# EAGLE design Auto20 (EAGLE 9.3.2)

## Sheet 1 of 3
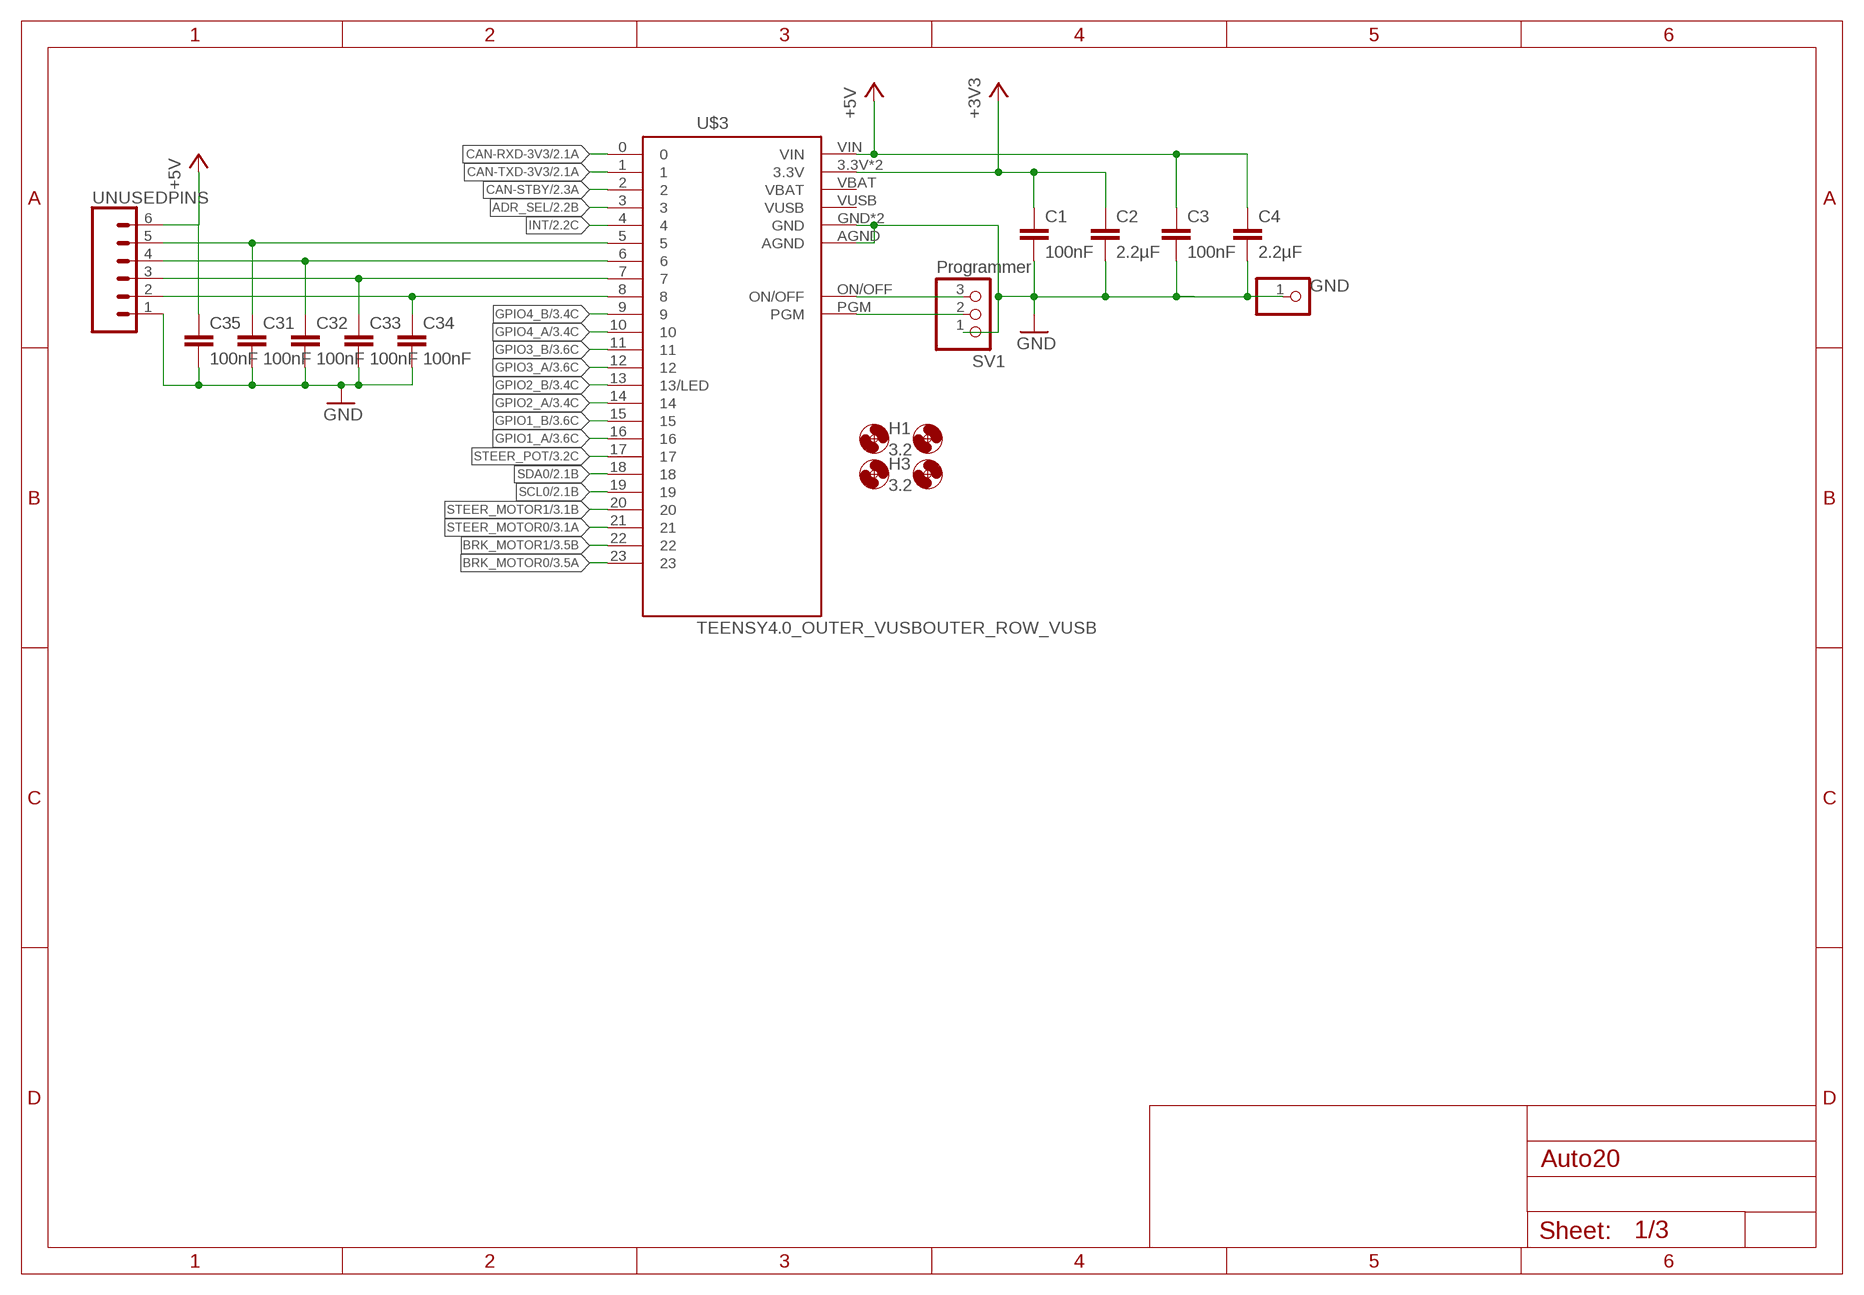
[diagram p0: schematic, sheet 1]

### Parts
C1  100nF  CAPACITOR_0805_L  [RESC0805_L]
C2  2.2µF  C-EUC1210  [C1210]
C3  100nF  CAPACITOR_0805_L  [RESC0805_L]
C4  2.2µF  C-EUC1210  [C1210]
C31  100nF  CAPACITOR_0805_L  [RESC0805_L]
C32  100nF  CAPACITOR_0805_L  [RESC0805_L]
C33  100nF  CAPACITOR_0805_L  [RESC0805_L]
C34  100nF  CAPACITOR_0805_L  [RESC0805_L]
C35  100nF  CAPACITOR_0805_L  [RESC0805_L]
GND  PINHD-1X1  [1X01]
H1  3.2  MOUNT-HOLE3.2  [3,2]
H2  3.2  MOUNT-HOLE3.2  [3,2]
H3  3.2  MOUNT-HOLE3.2  [3,2]
H4  3.2  MOUNT-HOLE3.2  [3,2]
SV1  Programmer  PINHD-1X3  [1X03]
U$3  TEENSY4.0_OUTER_VUSBOUTER_ROW_VUSB  [TEENSY_4.0_OUTER_VUSB]
UNUSEDPINS  CONN_06LOCK  [1X06_LOCK]

### Nets
+3V3: C1.1 C2.1 U$3.3.3V U$3.3.3V1(3.3V) ; also sheet 2
+5V: C3.1 C4.1 C35.1 U$3.VIN UNUSEDPINS.6 ; also sheet 2,3
ADR_SEL: U$3.3 ; also sheet 2
BRK_MOTOR0: U$3.23 ; also sheet 3
BRK_MOTOR1: U$3.22 ; also sheet 3
CAN-RXD-3V3: U$3.0 ; also sheet 2
CAN-STBY: U$3.2 ; also sheet 2
CAN-TXD-3V3: U$3.1 ; also sheet 2
GND: C1.2 C2.2 C3.2 C4.2 C31.2 C32.2 C33.2 C34.2 C35.2 GND.1 SV1.1 U$3.AGND U$3.GND U$3.GND1(GND) UNUSEDPINS.1 ; also sheet 2,3
GPIO1_A: U$3.16 ; also sheet 3
GPIO1_B: U$3.15 ; also sheet 3
GPIO2_A: U$3.14 ; also sheet 3
GPIO2_B: U$3.13(13/LED) ; also sheet 3
GPIO3_A: U$3.12 ; also sheet 3
GPIO3_B: U$3.11 ; also sheet 3
GPIO4_A: U$3.10 ; also sheet 3
GPIO4_B: U$3.9 ; also sheet 3
INT: U$3.4 ; also sheet 2
N$1: C31.1 U$3.5 UNUSEDPINS.5
N$3: SV1.3 U$3.ON/OFF
N$4: SV1.2 U$3.PGM
N$10: C32.1 U$3.6 UNUSEDPINS.4
N$12: C33.1 U$3.7 UNUSEDPINS.3
N$13: C34.1 U$3.8 UNUSEDPINS.2
SCL0: U$3.19 ; also sheet 2
SDA0: U$3.18 ; also sheet 2
STEER_MOTOR0: U$3.21 ; also sheet 3
STEER_MOTOR1: U$3.20 ; also sheet 3
STEER_POT: U$3.17 ; also sheet 3
Unconnected: U$3.VBAT U$3.VUSB

## Sheet 2 of 3
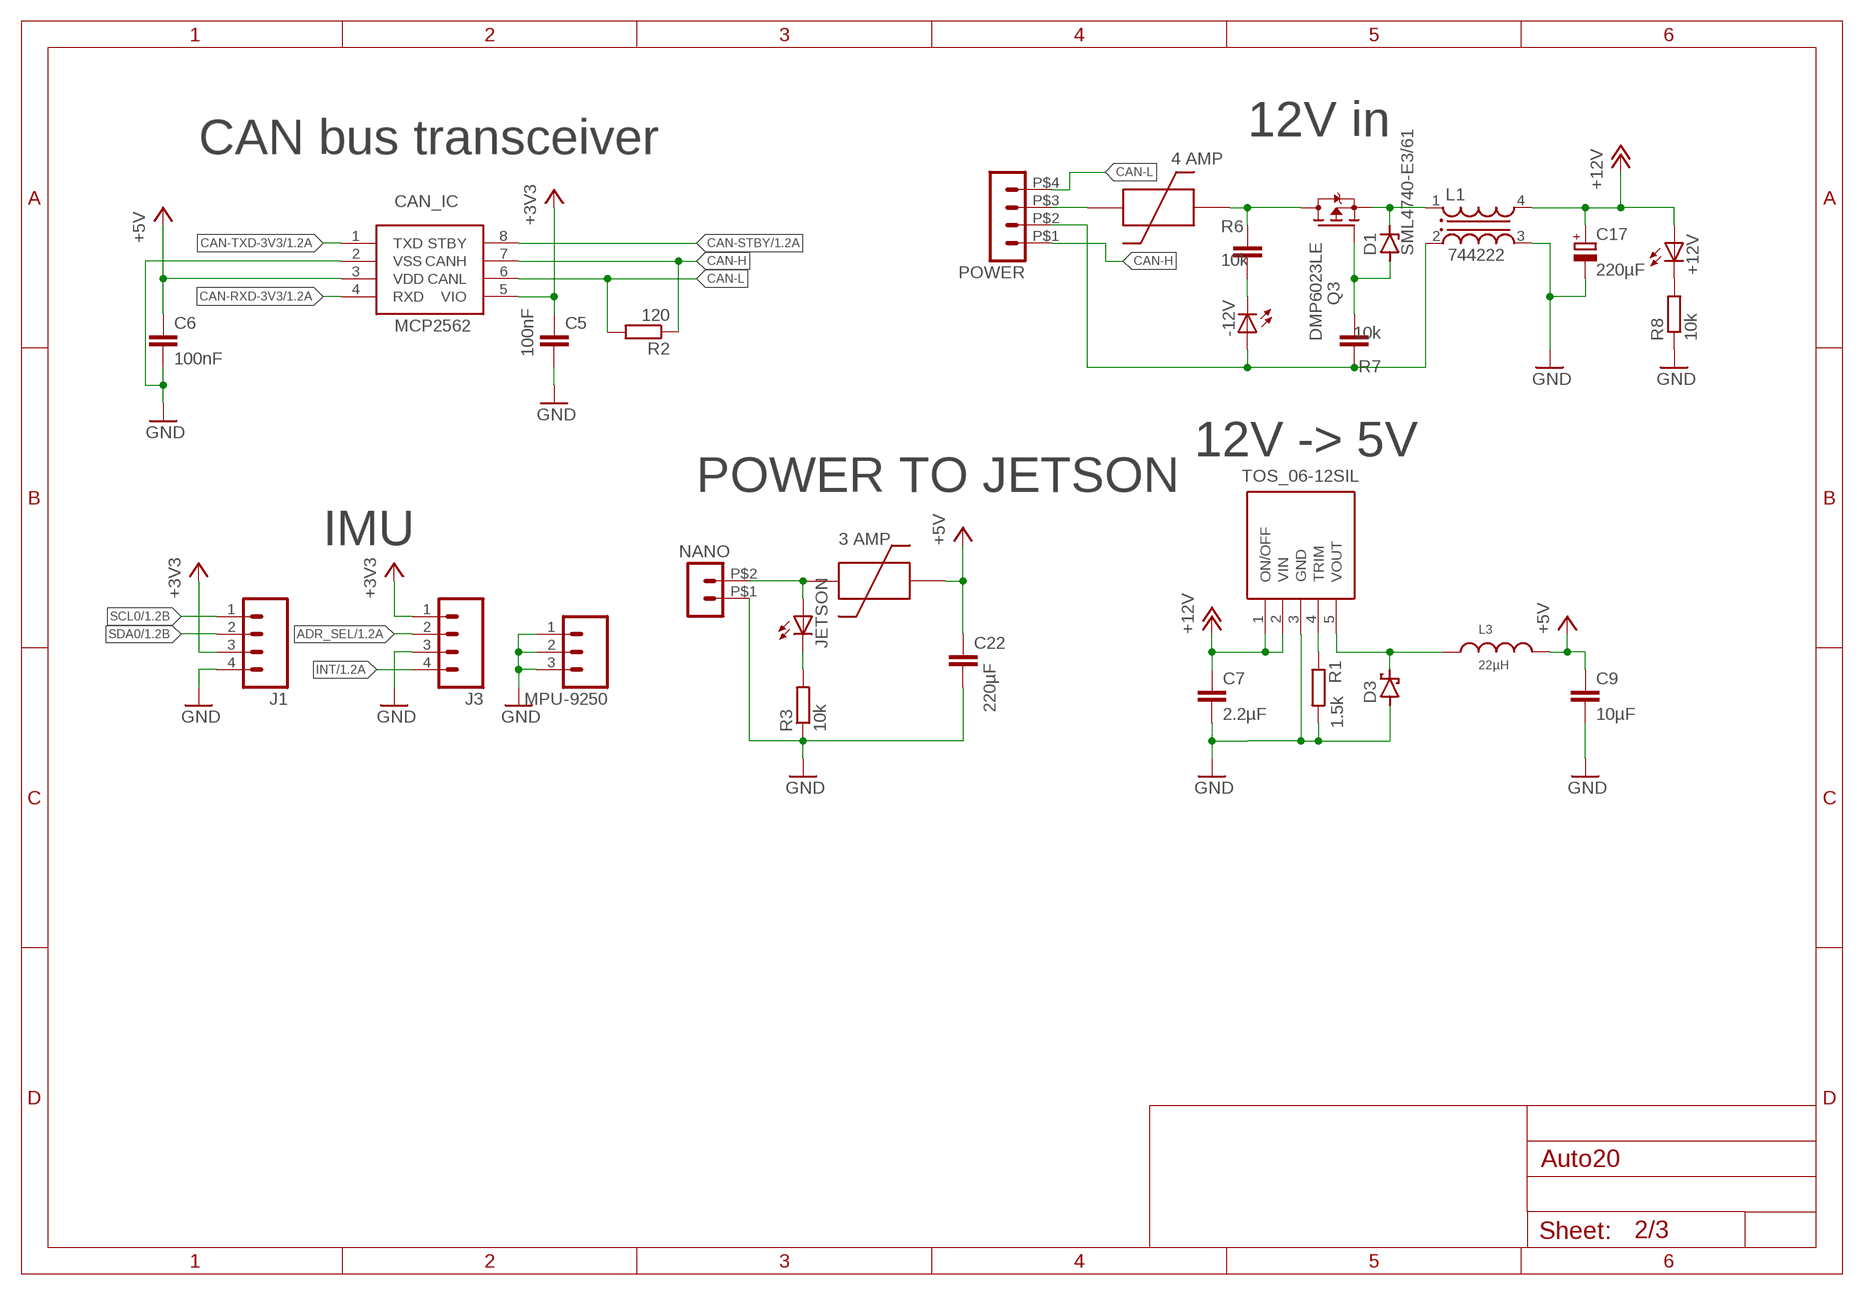
[diagram p1: schematic, sheet 2]

### Parts
+12V  LEDSMT1206  [1206]
-12V  LEDSMT1206  [1206]
C5  100nF  CAPACITOR_0805_L  [RESC0805_L]
C6  100nF  CAPACITOR_0805_L  [RESC0805_L]
C7  2.2µF  C-EUC1210  [C1210]
C9  10µF  C-EUC1210  [C1210]
C17  220µF  CPOL-EUE  [PANASONIC_E]
C22  220µF  C-EUC1210  [C1210]
CAN_IC  MCP2562  [SOIC127P600X175-8]
D1  SML4740-E3/61  ZENERSMA  [DO214AC]
D3  SBR1U150SA  SBRSMA  [DO214AC]
IC1  TOS_06-12SIL  [TOS-06-12SIL-6A]
J1  M04PTH  [1X04]
J3  M04PTH  [1X04]
JETSON  LEDSMT1206  [1206]
L1  744222  WE-SL2_744222  [WE-SL2]
L3  22µH  WE-PD_7345_PLASTIC_7447779122  [WE-PD_7332/7345_PLASTIC_BASE]
MPU-9250  M03PTH  [1X03]
NANO  HEADER_POS2_43045-0200  [43045-0200]
POWER  HEADER_POS4_43045-0401  [43045-0400]
Q3  DMP6023LE  BSP170P  [SOT223]
R1  1.5k  R-EU_R0805  [R0805]
R2  120  R-EU_R0603  [R0603]
R3  10k  R-EU_R0805  [R0805]
R6  10k  CAPACITOR_0805_L  [RESC0805_L]
R7  10k  CAPACITOR_0805_L  [RESC0805_L]
R8  10k  R-EU_R0805  [R0805]
U$1  SMF_OMNI-BLOK_FUSE_BLOCK  [SMF_OMNI-BLOK_FUSE_BLOCK]
U$2  SMF_OMNI-BLOK_FUSE_BLOCK  [SMF_OMNI-BLOK_FUSE_BLOCK]

### Nets
+3V3: C5.1 CAN_IC.5(VIO) J1.3 J3.1 ; also sheet 1
+5V: C6.1 C9.1 C22.1 CAN_IC.3(VDD) L3.2 U$1.PIN2 ; also sheet 1,3
+12V: +12V.A C7.1 C17.+ IC1.1(ON/OFF) IC1.2(VIN) L1.4
ADR_SEL: J3.2 ; also sheet 1
CAN-H: CAN_IC.7(CANH) POWER.P$1 R2.1
CAN-L: CAN_IC.6(CANL) POWER.P$4 R2.2
CAN-RXD-3V3: CAN_IC.4(RXD) ; also sheet 1
CAN-STBY: CAN_IC.8(STBY) ; also sheet 1
CAN-TXD-3V3: CAN_IC.1(TXD) ; also sheet 1
GND: C5.2 C6.2 C7.2 C9.2 C17.- C22.2 CAN_IC.2(VSS) D3.A IC1.3(GND) J1.4 J3.3 L1.3 MPU-9250.1 MPU-9250.2 MPU-9250.3 NANO.P$1 R1.2 R3.1 R8.1 ; also sheet 1,3
INT: J3.4 ; also sheet 1
N$5: D3.C IC1.5(VOUT) L3.1
N$6: POWER.P$3 U$2.PIN1
N$7: IC1.4(TRIM) R1.1
N$9: JETSON.C R3.2
N$11: JETSON.A NANO.P$2 U$1.PIN1
N$24: D1.C L1.1 Q3.3(S)
N$25: -12V.A L1.2 POWER.P$2 R7.1
N$27: Q3.2(D) Q3.4(D) R6.1 U$2.PIN2
N$28: D1.A Q3.1(G) R7.2
N$31: -12V.C R6.2
N$32: +12V.C R8.2
SCL0: J1.1 ; also sheet 1
SDA0: J1.2 ; also sheet 1

### Notes on the sheet
- 12V in
- CAN bus transceiver
- 4 AMP
- 12V -> 5V
- POWER TO JETSON
- IMU | 3 AMP

## Sheet 3 of 3
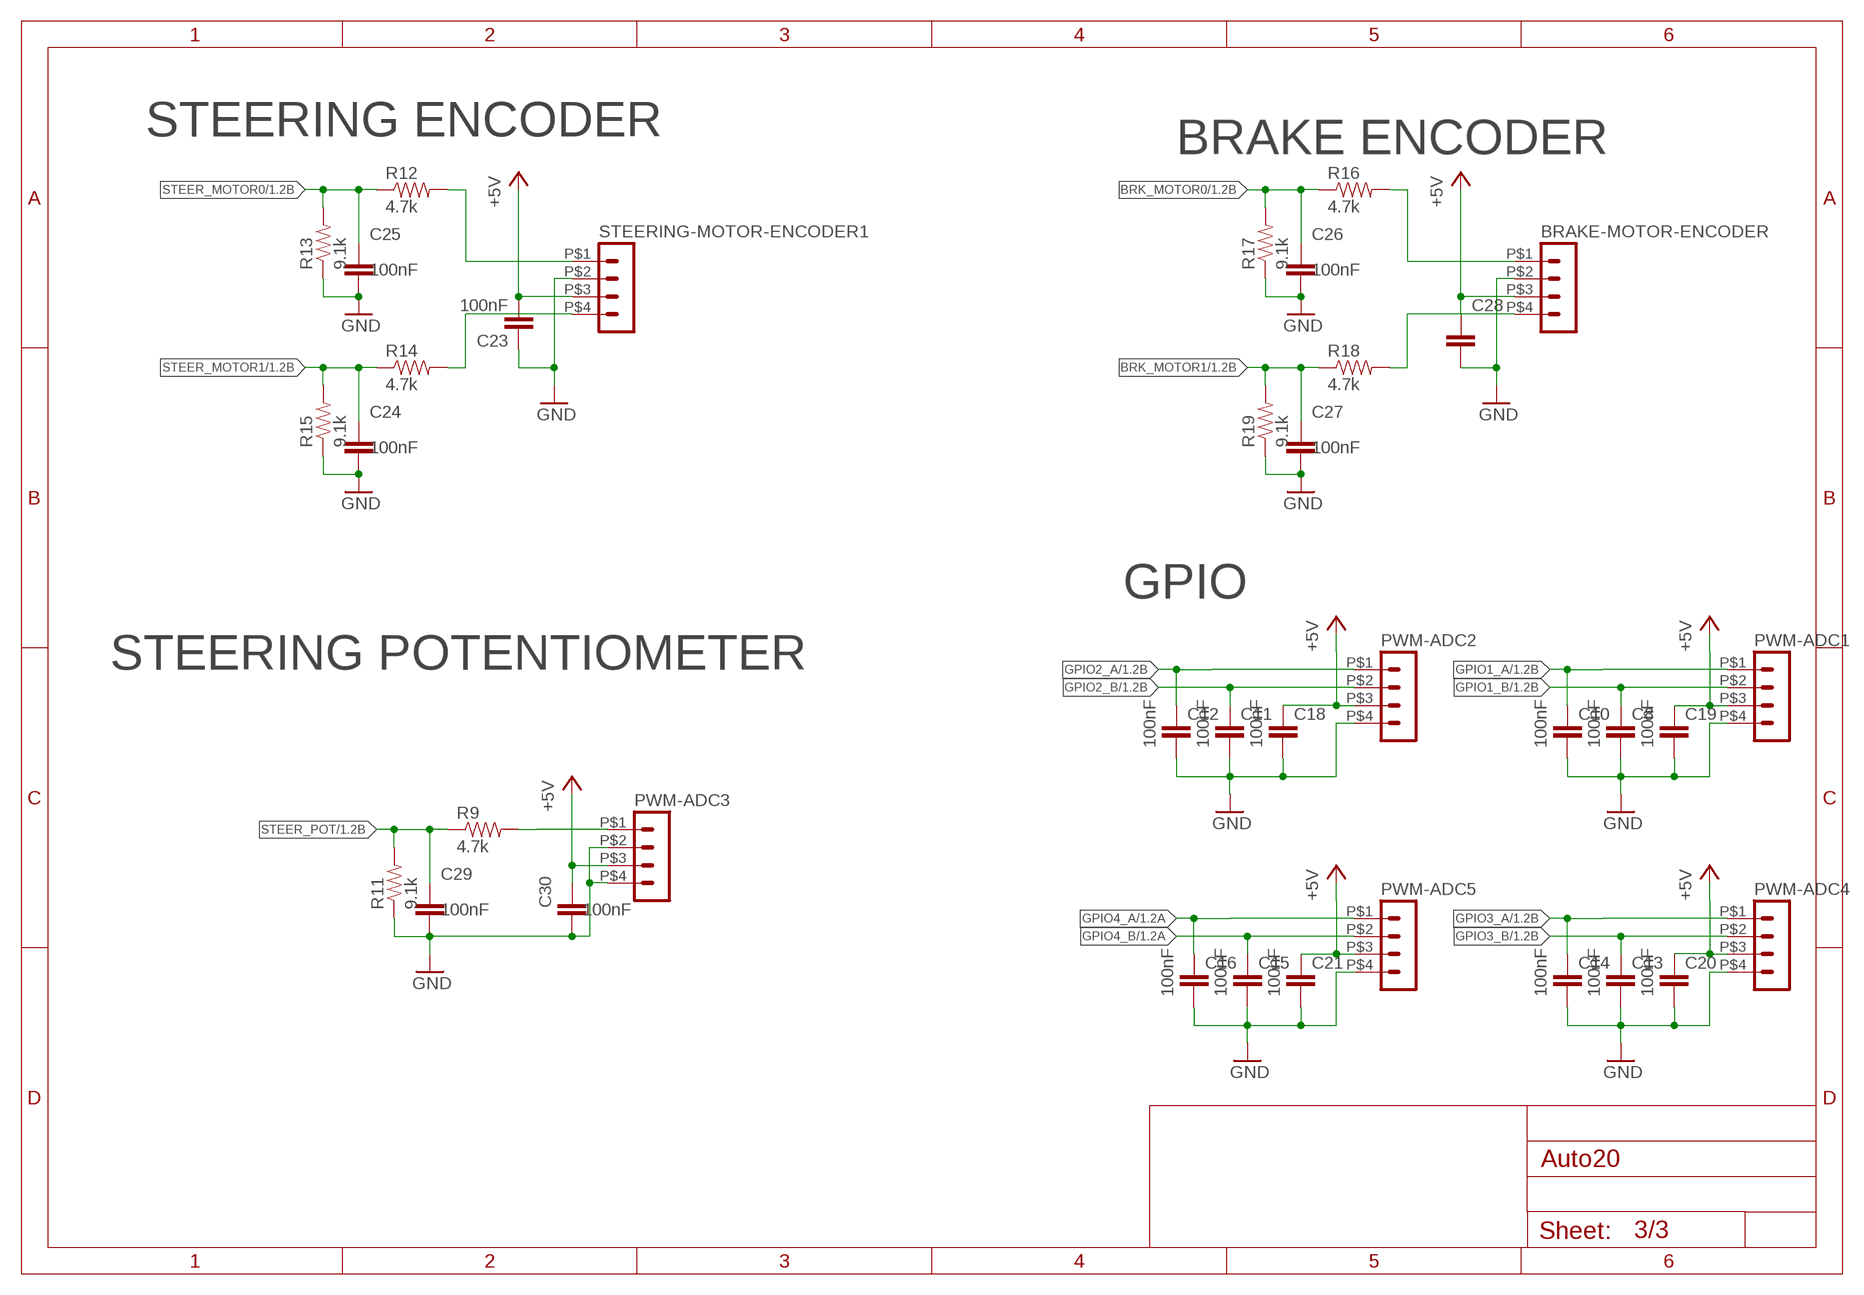
[diagram p2: schematic, sheet 3]

### Parts
BRAKE-MOTOR-ENCODER  HEADER_POS4_43045-0401  [43045-0400]
C8  100nF  CAPACITOR_0805_L  [RESC0805_L]
C10  100nF  CAPACITOR_0805_L  [RESC0805_L]
C11  100nF  CAPACITOR_0805_L  [RESC0805_L]
C12  100nF  CAPACITOR_0805_L  [RESC0805_L]
C13  100nF  CAPACITOR_0805_L  [RESC0805_L]
C14  100nF  CAPACITOR_0805_L  [RESC0805_L]
C15  100nF  CAPACITOR_0805_L  [RESC0805_L]
C16  100nF  CAPACITOR_0805_L  [RESC0805_L]
C18  100nF  CAPACITOR_0805_L  [RESC0805_L]
C19  100nF  CAPACITOR_0805_L  [RESC0805_L]
C20  100nF  CAPACITOR_0805_L  [RESC0805_L]
C21  100nF  CAPACITOR_0805_L  [RESC0805_L]
C23  100nF  CAPACITOR_0805_L  [RESC0805_L]
C24  100nF  CAPACITOR_0805_L  [RESC0805_L]
C25  100nF  CAPACITOR_0805_L  [RESC0805_L]
C26  100nF  CAPACITOR_0805_L  [RESC0805_L]
C27  100nF  CAPACITOR_0805_L  [RESC0805_L]
C28  100nF  CAPACITOR_0805_L  [RESC0805_L]
C29  100nF  CAPACITOR_0805_L  [RESC0805_L]
C30  100nF  CAPACITOR_0805_L  [RESC0805_L]
PWM-ADC1  HEADER_POS4_43045-0401  [43045-0400]
PWM-ADC2  HEADER_POS4_43045-0401  [43045-0400]
PWM-ADC3  HEADER_POS4_43045-0401  [43045-0400]
PWM-ADC4  HEADER_POS4_43045-0401  [43045-0400]
PWM-ADC5  HEADER_POS4_43045-0401  [43045-0400]
R9  4.7k  RESISTOR0805-RES  [0805]
R11  9.1k  RESISTOR0805-RES  [0805]
R12  4.7k  RESISTOR0805-RES  [0805]
R13  9.1k  RESISTOR0805-RES  [0805]
R14  4.7k  RESISTOR0805-RES  [0805]
R15  9.1k  RESISTOR0805-RES  [0805]
R16  4.7k  RESISTOR0805-RES  [0805]
R17  9.1k  RESISTOR0805-RES  [0805]
R18  4.7k  RESISTOR0805-RES  [0805]
R19  9.1k  RESISTOR0805-RES  [0805]
STEERING-MOTOR-ENCODER1  HEADER_POS4_43045-0401  [43045-0400]

### Nets
+5V: BRAKE-MOTOR-ENCODER.P$3 C18.1 C19.1 C20.1 C21.1 C23.2 C28.1 C30.1 PWM-ADC1.P$3 PWM-ADC2.P$3 PWM-ADC3.P$3 PWM-ADC4.P$3 PWM-ADC5.P$3 STEERING-MOTOR-ENCODER1.P$3 ; also sheet 1,2
ADC3-RAW: PWM-ADC3.P$1 R9.2
ADC9-RAW: BRAKE-MOTOR-ENCODER.P$4 R18.2
ADC9-RAW1: R14.2 STEERING-MOTOR-ENCODER1.P$4
BRK_MOTOR0: C26.1 R16.1 R17.2 ; also sheet 1
BRK_MOTOR1: C27.1 R18.1 R19.2 ; also sheet 1
GND: BRAKE-MOTOR-ENCODER.P$2 C8.2 C10.2 C11.2 C12.2 C13.2 C14.2 C15.2 C16.2 C18.2 C19.2 C20.2 C21.2 C23.1 C24.2 C25.2 C26.2 C27.2 C28.2 C29.2 C30.2 PWM-ADC1.P$4 PWM-ADC2.P$4 PWM-ADC3.P$2 PWM-ADC3.P$4 PWM-ADC4.P$4 PWM-ADC5.P$4 R11.1 R13.1 R15.1 R17.1 R19.1 STEERING-MOTOR-ENCODER1.P$2 ; also sheet 1,2
GPIO1_A: C10.1 PWM-ADC1.P$1 ; also sheet 1
GPIO1_B: C8.1 PWM-ADC1.P$2 ; also sheet 1
GPIO2_A: C12.1 PWM-ADC2.P$1 ; also sheet 1
GPIO2_B: C11.1 PWM-ADC2.P$2 ; also sheet 1
GPIO3_A: C14.1 PWM-ADC4.P$1 ; also sheet 1
GPIO3_B: C13.1 PWM-ADC4.P$2 ; also sheet 1
GPIO4_A: C16.1 PWM-ADC5.P$1 ; also sheet 1
GPIO4_B: C15.1 PWM-ADC5.P$2 ; also sheet 1
N$2: BRAKE-MOTOR-ENCODER.P$1 R16.2
N$8: R12.2 STEERING-MOTOR-ENCODER1.P$1
STEER_MOTOR0: C25.1 R12.1 R13.2 ; also sheet 1
STEER_MOTOR1: C24.1 R14.1 R15.2 ; also sheet 1
STEER_POT: C29.1 R9.1 R11.2 ; also sheet 1

### Notes on the sheet
- STEERING ENCODER
- BRAKE ENCODER
- GPIO
- STEERING POTENTIOMETER

## Library data of the parts
+12V -12V JETSON = adafruit:LED: LED OSRAM: - CHIPLED LG R971, LG N971, LY N971, LG Q971, LY Q971, LO R971, LY R971 LH N974, LH R974 LS Q976, LO Q976, LY Q976 LO Q996 - Hyper CHIPLED LW Q18S LB Q993, LB Q99A, LB R99A - SideLED LS A670, LO A670, LY A670, LG A670, LP A670 LB A673, LV A673, LT A673, LW A673 LH A674 LY A675 LS A676, LA A676, LO A676, LY A676, LW A676 LS A679, LY A679, LG A679 - Hyper Micro SIDELED® LS Y876, LA Y876, LO Y876, LY Y876 LT Y87S - SmartLED LW L88C, LW L88S LB L89C, LB L89S, LG L890 LS L89K, LO L89K, LY L89K LS L896, LA L896, LO L896, LY L896 - TOPLED LS T670, LO T670, LY T670, LG T670, LP T670 LSG T670, LSP T670, LSY T670, LOP T670, LYG T670 LG T671, LOG T671, LSG T671 LB T673, LV T673, LT T673, LW T673 LH T674 LS T676, LA T676, LO T676, LY T676, LB T676, LH T676, LSB T676, LW T676 LB T67C, LV T67C, LT T67C, LS T67K, LO T67K, LY T67K, LW E67C LS E67B, LA E67B, LO E67B, LY E67B, LB E67C, LV E67C, LT E67C LW T67C LS T679, LY T679, LG T679 LS T770, LO T770, LY T770, LG T770, LP T770 LB T773, LV T773, LT T773, LW T773 LH T774 LS E675, LA E675, LY E675, LS T675 LS T776, LA T776, LO T776, LY T776, LB T776 LHGB T686 LT T68C, LB T68C - Hyper Mini TOPLED® LB M676 - Mini TOPLED Santana® LG M470 LS M47K, LO M47K, LY M47K Source: http://www.osram.convergy.de/
BRAKE-MOTOR-ENCODER POWER PWM-ADC1-PWM-ADC5 STEERING-MOTOR-ENCODER1 = con-molex-micro-fit-3_0:HEADER_POS4_?: Molex - Micro-Fit 3.0 Series connector, 3.00mm (0.118") pitch header, 4 positions.
C1 C3 C5 C6 C8 C10-C16 C18-C21 C23-C35 R6 R7 = Nordic_nRF:CAPACITOR: Generic chip capacitor
C2 C4 C7 C9 = rcl:C-EU: CAPACITOR, European symbol; SPICEPREFIX: C
C17 = rcl:CPOL-EU: POLARIZED CAPACITOR, European symbol; SPICEPREFIX: C
C22 = resistor:C-EU: CAPACITOR, European symbol
CAN_IC = MCP2562:MCP2562
D1 = Diode_Own:ZENER
D3 = Diode_Own:SBR
GND = adafruit:PINHD-1X1: Pin header 1x1 for 0.1" spacing With round pins
H1-H4 = holes:MOUNT-HOLE: MOUNTING HOLE with drill center marker
IC1 = SamacSys_Parts:TOS_06-12SIL: Non-Isolated DC-DC Converter 12V dc Input, 0.75 ??5V dc Output, 6A%0%0 Source: Datasheet <http://www.tracopower.com/products/tos.pdf>; DESCRIPTION: Non-Isolated DC-DC Converter 12V dc Input, 0.75 ??5V dc Output, 6A%0%0; HEIGHT: mm; MANUFACTURER_NAME: Traco Power; MANUFACTURER_PART_NUMBER: TOS 06-12SIL; RS_PART_NUMBER: 7066432; RS_PRICE-STOCK: https://uk.rs-online.com/web/p/products/7066432
J1 J3 = SparkFun-Connectors:M04: Header 4 Standard 4-pin 0.1" header. Use with straight break away headers (SKU : PRT-00116), right angle break away headers (PRT-00553), swiss pins (PRT-00743), machine pins (PRT-00117), and female headers (PRT-00115). Molex polarized connector foot print use with SKU : PRT-08231 with associated crimp pins and housings. 1MM SMD Version SKU: PRT-10208; PROD_ID: CONN-09696
L1 = Wurth_Elektronik_Passive_rev18f:WE-SL2: SMD Common-Mode Line Filter WE-SL2 For distortion-free removal of noise from transmitted electrical signals - Double current-compensated choke - Offering a wide band width with the core materials NiZn/MnZn -- Current compensated choke for data and signal lines -- Power supply systems -- Filter for measurement signals -- CAN <http://katalog.we-online.de/media/images/v2/Family_WE-SL2.jpg> Details see: http://katalog.we-online.de/en/pbs/WE-SL2? Updated by Dan Xu 2014-07-11 2014 (C) Würth Elektronik; WE-NUMBER: 744222/1000uH
L3 = Wurth_Elektronik_Passive_rev18f:WE-PD_7345_PLASTIC: SMD Shielded Power Inductor Characteristics Magnetically shielded version which results in a low leakage field High Saturation currents up to 25 A Very low self-losses at high switching frequency‘s Wide inductances spectrum available at all sizes Operating temperature: –40 °C to +125 °C Applications Perfectly suitable for switching regulators with extremely high efficiency Integrated DC/DC- converter Switching regulators with low operating voltages (Graphic cards, embedded PC-Cards, Mainboards) Plastic base: Because of the one piece construction these are more suitable for high vibration or shock applications <http://katalog.we-online.de/media/images/v2/Family_WE-PD.jpg> Details see: http://katalog.we-online.de/en/pbs/WE-PD? Updated by Dan Xu 2014-07-08 2014 (C) Wurth Elektronik; WE-NUMBER: 7447779122/22uH
MPU-9250 = SparkFun-Connectors:M03: Header 3 Standard 3-pin 0.1" header. Use with straight break away headers (SKU : PRT-00116), right angle break away headers (PRT-00553), swiss pins (PRT-00743), machine pins (PRT-00117), and female headers (PRT-00115). Molex polarized connector foot print use with SKU : PRT-08232 with associated crimp pins and housings.
NANO = con-molex-micro-fit-3_0:HEADER_POS2_?: Molex - Micro-Fit 3.0 Series connector, 3.00mm (0.118") pitch header, 2 positions.
Q3 = transistor-fet:BSP170P: SIPMOS(R) Small-Signal-Transistor P-Channel, Enhancement mode Source: http://www.infineon.com/upload/Document/BSP170P_Rev2.4.pdf
R1-R3 R8 = rcl:R-EU_: RESISTOR, European symbol; SPICEPREFIX: R
R9 R11-R19 = SparkFun-Resistors:RESISTOR: Resistor Basic schematic elements and footprints for 0603, 1206, and PTH resistors.
SV1 = pinhead:PINHD-1X3: PIN HEADER
U$1 U$2 = SMF_OMNI-BLOK_FUSE_BLOCK:SMF_OMNI-BLOK_FUSE_BLOCK
U$3 = Teensy_4_0:TEENSY4.0_OUTER_VUSB
UNUSEDPINS = SparkFun-Connectors:CONN_06: Multi connection point. Often used as Generic Header-pin footprint for 0.1 inch spaced/style header connections On any of the 0.1 inch spaced packages, you can populate with these: Break Away Headers - Straight <https://www.sparkfun.com/products/116> (PRT-00116) Break Away Male Headers - Right Angle <https://www.sparkfun.com/products/553> (PRT-00553) Female Headers <https://www.sparkfun.com/products/115> (PRT-00115) Break Away Headers - Machine Pin <https://www.sparkfun.com/products/117> (PRT-00117) Break Away Female Headers - Swiss Machine Pin <https://www.sparkfun.com/products/743> (PRT-00743) Arduino Stackable Header - 6 Pin <https://www.sparkfun.com/products/9280> (PRT-09280) For SCREWTERMINALS and SPRING TERMINALS visit here: Screw Terimnals on SparkFun.com <https://www.sparkfun.com/search/results?term=Screw+Terminals> (5mm/3.5mm/2.54mm spacing) This device is also useful as a general connection point to wire up your design to another part of your project. Our various solder wires solder well into these plated through hole pads. Hook-Up Wire - Assortment (Stranded, 22 AWG) <https://www.sparkfun.com/products/11375> (PRT-11375) Hook-Up Wire - Assortment (Solid Core, 22 AWG) <https://www.sparkfun.com/products/11367> (PRT-11367) View the entire wire category on our website here <https://www.sparkfun.com/categories/141>

## Board
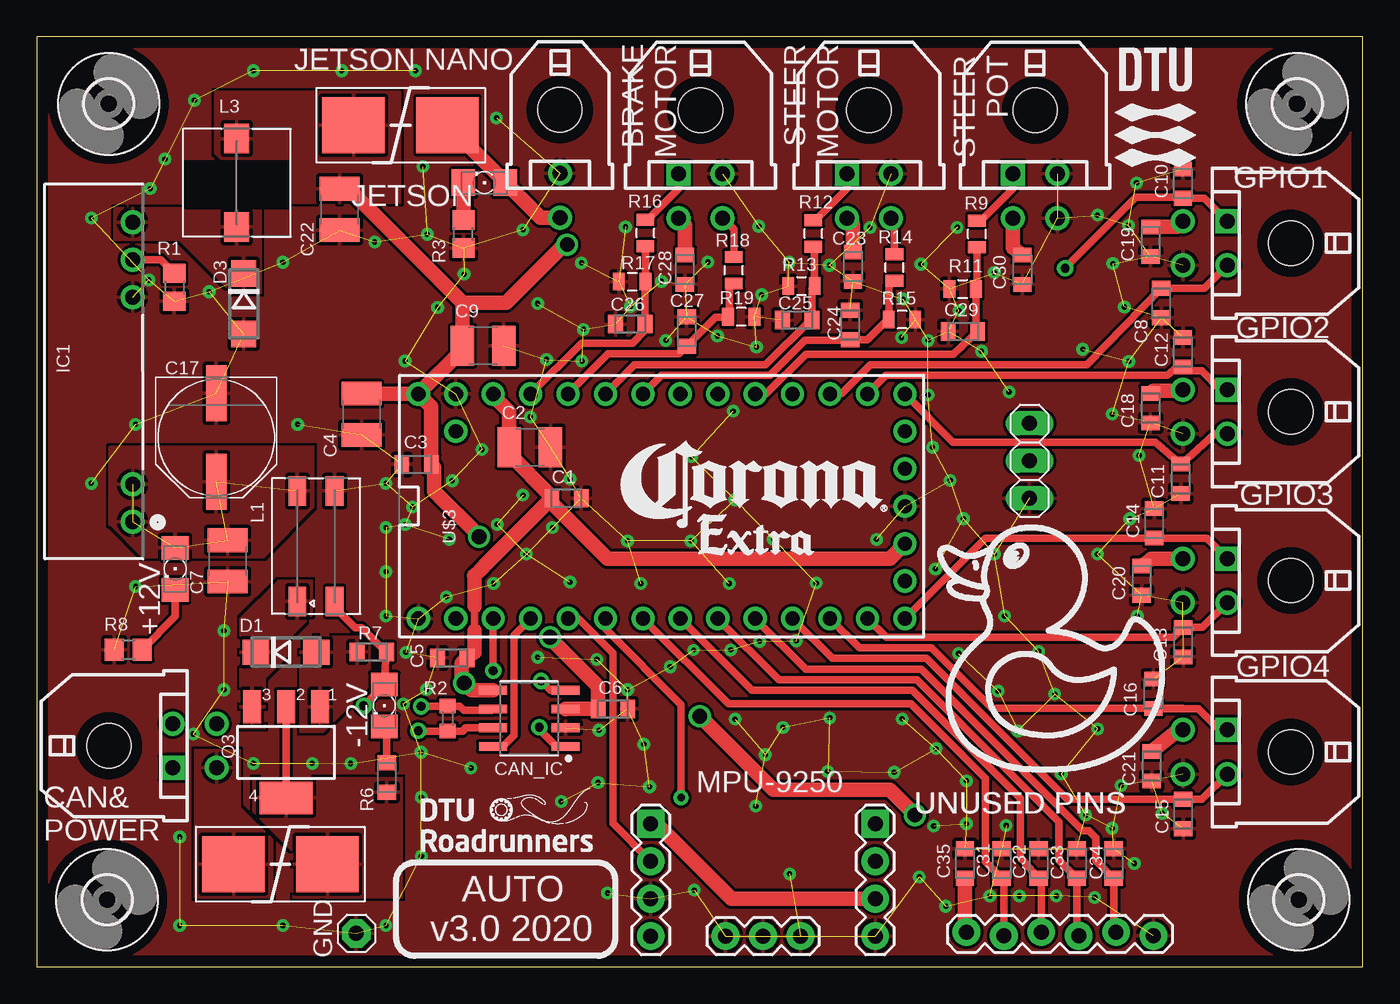
[diagram p3: board, top side]
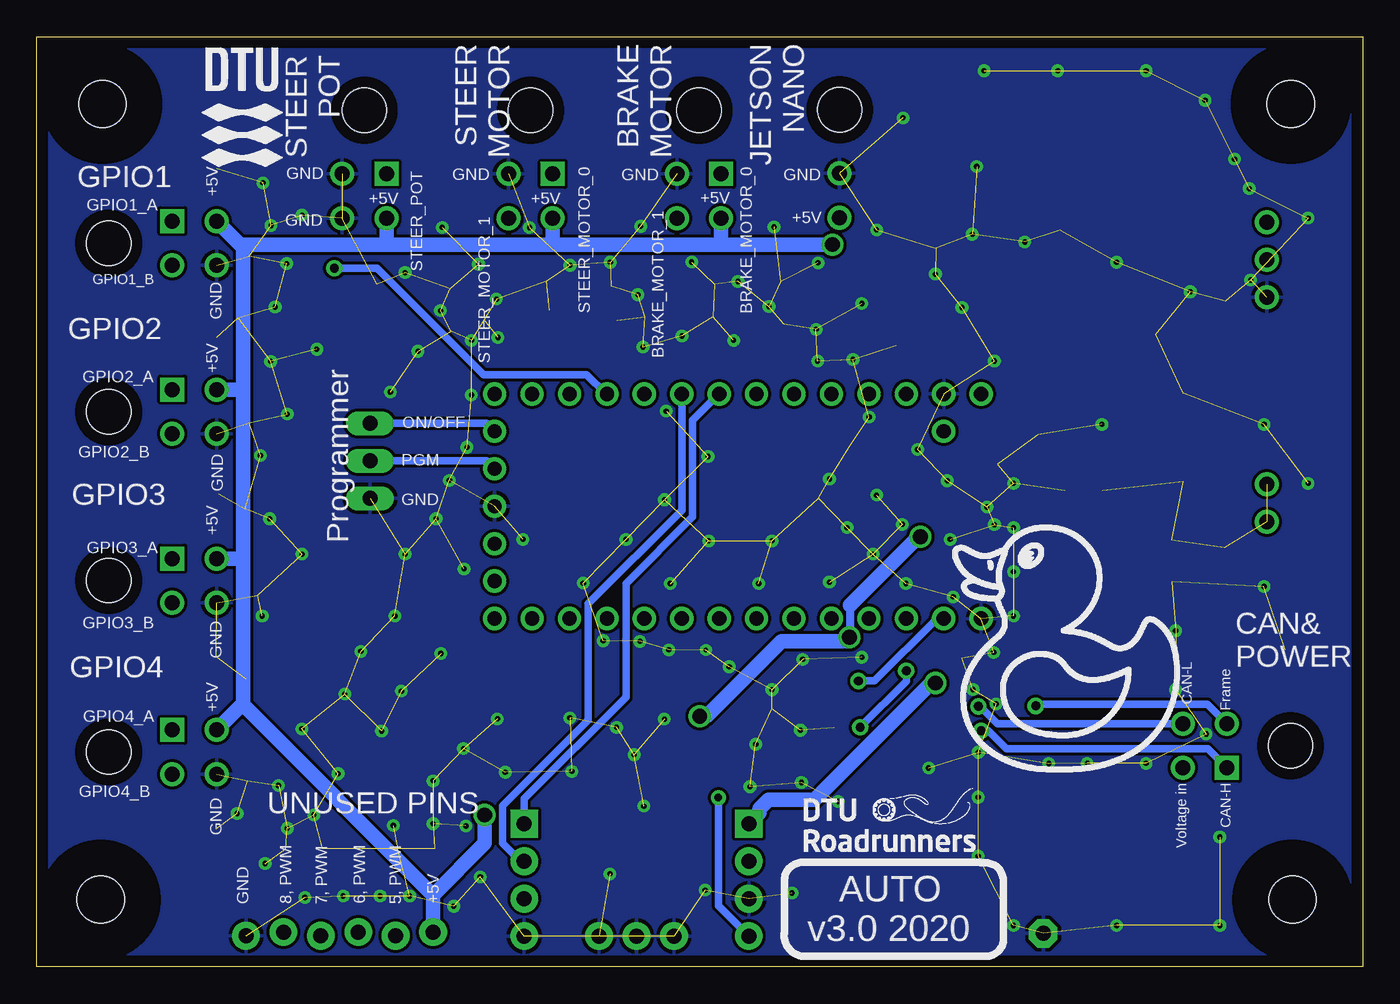
[diagram p4: board, bottom side, seen from below]

Size 90 x 63.1 mm. Coordinates in mm from the lower left corner, seen from the top.
Outline: 0,0 90,0 90,63.1 0,63.1 0,0
Copper layers (1*16): Top 0.035mm / dielectric 1.5mm / Bottom 0.035mm
Design rules "CustomSparkFun2Layer": minimum track width 16mil, minimum drill 20mil, track to track 8mil, track to pad 8mil, pad to pad 8mil, via to via 8mil, smd to smd 8mil, copper to edge 30mil, drill to drill 8mil, minimum pad ring 12mil, minimum via ring 10mil, stop-mask expansion 4mil, vias tented up to drill 25mil, thermal gap 10mil

### Footprints (pad centres in the part's own frame; a part is rotated, then mirrored left to right if it is on the bottom)
1206 = smd 1.6 x 1.803: A -1.422,0; C 1.422,0
43045-0400 = drill 1.02 square: P$1 1.5,4.32 | drill 1.02: P$2 -1.5,4.32; P$3 1.5,7.32; P$4 -1.5,7.32 | hole 3: 0,0
RESC0805_L = smd 1 x 1.25: 1 -1,0; 2 1,0
C1210 = smd 1.6 x 2.7: 1 -1.4,0; 2 1.4,0
PANASONIC_E = smd 3.8 x 1.4: + 3,0; - -3,0
SOIC127P600X175-8 = smd 1.901 x 0.599: 1 -2.455,1.905; 2 -2.455,0.635; 3 -2.455,-0.635; 4 -2.455,-1.905; 5 2.455,-1.905; 6 2.455,-0.635; 7 2.455,0.635; 8 2.455,1.905
DO214AC = smd 1.8 x 1.7: A 2.05,0; C -2.05,0
1X01 = drill 1.016 pad 1.93 octagon: 1 0,0
3,2 = hole 3.2: 0,0
TOS-06-12SIL-6A = drill 1.02 pad 1.52: 1 0,0; 2 2.54,0; 3 15.24,0; 4 17.78,0; 5 20.32,0
1X04 = drill 1.016 pad 1.88 square: 1 0,0 | drill 1.016 pad 1.88: 2 2.54,0; 3 5.08,0; 4 7.62,0
WE-SL2 = smd 2 x 1.2: 1 -3.75,1.27; 2 -3.75,-1.27; 3 3.75,-1.27; 4 3.75,1.27
WE-PD_7332/7345_PLASTIC_BASE = smd 2 x 1.7: 1 -3,0; 2 3,0
1X03 = drill 1.016 pad 1.88: 1 0,0; 2 2.54,0; 3 5.08,0
43045-0200 = drill 1.02: P$1 0,4.32; P$2 0,7.32 | hole 3: 0,0
SOT223 = smd 1.219 x 2.235: 1 -2.311,-3.099; 2 0,-3.099; 3 2.311,-3.099 | smd 3.6 x 2.2: 4 0,3.099
R0805 = smd 1.3 x 1.5: 1 -0.95,0; 2 0.95,0
R0603 = smd 1 x 1.1: 1 -0.85,0; 2 0.85,0
0805 = smd 0.8 x 1.2: 1 -0.9,0; 2 0.9,0
1X03' = drill 1.016 long: 1 -2.54,0; 2 0,0; 3 2.54,0
SMF_OMNI-BLOK_FUSE_BLOCK = smd 4.242 x 3.81: PIN1 -3.175,0; PIN2 3.2,0
TEENSY_4.0_OUTER_VUSB = drill 0.965: 0 -7.62,13.97; 1 -7.62,11.43; 2 -7.62,8.89; 3 -7.62,6.35; 3.3V 7.62,11.43; 3.3V1 -2.54,-16.51; 4 -7.62,3.81; 5 -7.62,1.27; 6 -7.62,-1.27; 7 -7.62,-3.81; 8 -7.62,-6.35; 9 -7.62,-8.89; 10 -7.62,-11.43; 11 -7.62,-13.97; 12 -7.62,-16.51; 13 7.62,-16.51; 14 7.62,-13.97; 15 7.62,-11.43; 16 7.62,-8.89; 17 7.62,-6.35; 18 7.62,-3.81; 19 7.62,-1.27; 20 7.62,1.27; 21 7.62,3.81; 22 7.62,6.35; 23 7.62,8.89; AGND 7.62,13.97; GND -7.62,16.51; GND1 0,-16.51; ON/OFF 5.08,-16.51; PGM 2.54,-16.51; VBAT -5.08,-16.51; VIN 7.62,16.51; VUSB 5.08,13.97
1X06_LOCK = drill 1.016 pad 1.88: 1 0,0; 2 2.54,-0.254; 3 5.08,0; 4 7.62,-0.254; 5 10.16,0; 6 12.7,-0.254

### Placement (x,y rotation side)
+12V  9.39,27 270 top
-12V  23.59,17.72 270 top
BRAKE-MOTOR-ENCODER  45.05,58.12 180 top
C1  35.95,31.79 0 top
C2  33.46,35.25 0 top
C3  25.78,34.09 180 top
C4  22.05,37.49 270 top
C5  28.21,20.96 180 top
C6  39.11,17.49 0 top
C7  12.95,27.54 270 top
C8  76.32,45.04 270 top
C9  30.29,42.14 0 top
C10  77.79,53.14 90 top
C11  77.64,33.11 270 top
C12  77.79,41.7 90 top
C13  77.81,22.02 270 top
C14  75.85,30.09 90 top
C15  77.81,10.36 270 top
C16  75.79,18.52 90 top
C17  12.18,35.91 270 top
C18  75.6,37.9 270 top
C19  75.6,49.2 270 top
C20  75,26.2 270 top
C21  75.68,13.61 270 top
C22  20.55,51.39 270 top
C23  55.4,47.5 90 top
C24  55.21,43.54 90 top
C25  51.62,43.88 180 top
C26  40.28,43.61 180 top
C27  44.11,43.11 90 top
C28  43.99,47.3 270 top
C29  62.87,43.11 180 top
C30  66.9,47.3 270 top
C31  65.5,7 90 top
C32  68,7 90 top
C33  70.6,7 90 top
C34  73.1,7 90 top
C35  63,7 90 top
CAN_IC  33.42,16.85 180 top
D1  16.92,21.34 0 top
D3  14.04,44.98 270 top
GND  21.69,2.26 0 top
H1  85.55,58.55 0 top
H2  85.66,4.55 0 top
H3  4.77,4.55 0 top
H4  4.88,58.55 0 top
IC1  6.5,30.2 90 top
J1  56.91,9.7 270 top
J3  41.67,9.7 270 top
JETSON  30.38,53.21 180 top
L1  18.95,28.54 90 top
L3  13.58,53.2 90 top
MPU-9250  46.75,2.08 0 top
NANO  35.51,58.15 180 top
POWER  4.9,15 270 top
PWM-ADC1  85.12,49.09 90 top
PWM-ADC2  85.12,37.66 90 top
PWM-ADC3  67.77,58.12 180 top
PWM-ADC4  85.12,26.2 90 top
PWM-ADC5  85.12,14.57 90 top
Q3  16.92,14.55 180 top
R1  9.34,46.1 270 top
R2  27.89,16.84 90 top
R3  28.96,49.72 90 top
R6  23.76,12.84 90 top
R7  22.74,21.36 180 top
R8  6.2,21.52 0 top
R9  63.81,49.73 90 top
R11  62.84,45.99 0 top
R12  52.71,49.76 90 top
R13  51.9,46.19 0 top
R14  58.21,47.45 90 top
R15  58.73,43.91 180 top
R16  41.31,49.79 90 top
R17  40.41,46.49 0 top
R18  47.31,47.26 90 top
R19  47.82,44.11 180 top
STEERING-MOTOR-ENCODER1  56.48,58.12 180 top
SV1  Programmer  [1X03']  67.39,34.33 90 top
U$1  24.7,57.1 180 top
U$2  16.53,6.96 0 top
U$3  42.41,31.25 90 top
U$4  [CORONA]  39.3,27.2 0 top
U$5  [RUBBERDUCK]  61,13 0 top
U$6  [ROADRUNNERS-FULL]  32.01,10.07 0 top
U$8  [RUBBERDUCK]  28,13 0 bottom
U$10  [DTU-SMALL-5MM]  76,59 0 top
U$13  [DTU-SMALL-5MM]  76,59 0 bottom
U$14  [ROADRUNNERS-FULL]  32.01,10.07 0 bottom
UNUSEDPINS  75.8,2.1 180 top

### Tracks (layer width: path | path; a pad name or v marks a point on that pad's centre or on a via)
+3V3  (via drill 1)
  Top 0.5: 29.71,22.81 29.71,24.45
  Top 1: U$3.3.3V 30.98,38.73 32.06,37.65 C2.1 32.06,34.8 34.95,31.91 C1.1 | U$3.3.3V1 57.91,27.7 38.73,27.7 34.95,31.48 C1.1 | J3.1 42.07,9.7 47.15,4.62 J1.3 | 29.71,22.81 29.71,22.15 29.73,22.13 29.73,21.35 C5.1 28.85,20.6 28.85,19.41 v29,19.25 29.5,18.75 CAN_IC.5 | C1.1 34.95,31.75 C1.1 | C1.1 30.63,27.47 30.08,26.92 29.68,26.52 29.71,26.49 29.71,24.45
  Bottom 1: v29,19.25 29.29,19.25 37.21,11.33 40.33,11.33 40.94,10.73 40.94,10.43 J3.1
+5V  (via drill 1)
  Top 1: C4.1 U$3.VIN | U$3.VIN 26.78,37.99 C3.1 | CAN_IC.3 C6.1 38.11,19.03 34.84,22.3 v34.84,22.36 | PWM-ADC5.P$3 77.52,16.07 C21.1 | PWM-ADC4.P$3 76,27.7 75.65,27.7 C20.1 | PWM-ADC3.P$3 66.27,48.78 C30.1 | STEERING-MOTOR-ENCODER1.P$3 55.4,50.38 C23.2 | BRAKE-MOTOR-ENCODER.P$3 43.99,50.36 C28.1 | v36,49 35.9,49.1 32.83,46.03 31.87,45.07 28.89,45.07 | C35.1 63,2.45 UNUSEDPINS.6 | 28.89,45.07 21.17,52.79 C22.1 | 28.89,45.07 C9.1 28.89,41.88 U$3.VIN | C3.1 26.97,33.9 | C19.1 77.41,50.2 PWM-ADC1.P$3 | v30.01,29.18 30.01,29.23 26.97,32.27 26.97,33.9 | C3.1 26.97,33.9 | v59.6,10.3 57.9,12 50,12 v45,17 | C18.1 75.8,39.1 77.74,39.1 PWM-ADC2.P$3
  Bottom 0.55: 34.79,24.54 34.79,22.41 v34.84,22.36
  Bottom 1: v36,49 43.5,49 | 43.5,49 55,49 | 55,49 66.2,49 | 66.2,49 76,49 | 76,49 76.21,49 | BRAKE-MOTOR-ENCODER.P$3 43.55,49.05 43.5,49 | STEERING-MOTOR-ENCODER1.P$3 54.98,49.02 55,49 | PWM-ADC3.P$3 66.27,49.07 66.2,49 | 76,49 76,39 | 76,39 76,28 76,27.7 | 76,27.7 76,17.87 | 76,17.87 PWM-ADC5.P$3 | 76,27.7 76.5,27.7 PWM-ADC4.P$3 | 76,39 76.16,39.16 PWM-ADC2.P$3 | 63.1,4.87 UNUSEDPINS.6 | 76,49 76.21,49 | 76.21,49 PWM-ADC1.P$3 | 34.79,24.54 30.15,29.18 v30.01,29.18 | 63.1,4.87 59.6,8.37 v59.6,10.3 | v34.84,22.36 35.12,22.08 39.46,22.08 44.54,17 v45,17 | 76,17.87 76,17.77 63.1,4.87
  pour Top: 12.1,55.2 12.1,59.4 24.65,59.4 24.65,51.8 15.5,51.8
+12V  (5 unrouted)
  pour Top: 5,30 7.2,27.8 15.4,27.8 18.8,31.2 18.8,35.3 5,35.3 4.9,35.2 4.9,30
ADC3-RAW
  Top 0.5: PWM-ADC3.P$1 66.27,52.8 64.1,50.63 R9.2
ADC9-RAW
  Top 0.5: R18.2 47.31,50.04 BRAKE-MOTOR-ENCODER.P$4
ADC9-RAW1
  Top 0.5: R14.2 58.21,50.57 STEERING-MOTOR-ENCODER1.P$4
ADR_SEL
  Top 0.5: U$3.3 36.76,23.63 39.11,21.28 39.11,9.72 J3.2
BRK_MOTOR0
  Top 0.5: U$3.23 36.97,42.32 40.42,42.32 41.28,43.18 C26.1 41.28,46.46 | 41.28,46.46 R17.2 | R17.2 R16.1 | 41.28,46.46 R17.2
BRK_MOTOR1
  Top 0.5: U$3.22 38.78,41.59 43.59,41.59 C27.1 46.07,44.07 46.96,44.07 R19.2 47.01,44.2 47.01,46.06 R18.1
CAN-H  (via drill 0.6)
  Top 0.5: v25.89,16.02 25.92,15.99 R2.1 28.89,15.99 29.1,16.2 CAN_IC.7
  Bottom 0.5: POWER.P$1 10.5,14.78 24.18,14.78 25.41,16.02 v25.89,16.02
CAN-L  (via drill 0.6)
  Top 0.5: v26.09,17.67 26.11,17.69 R2.2 28.71,17.69 29,17.4 30.88,17.4 CAN_IC.6
  Bottom 0.5: POWER.P$4 24.8,16.5 25.97,17.67 v26.09,17.67
CAN-RXD-3V3  (via drill 0.6)
  Top 0.5: v34.23,19.39 34.87,18.75 CAN_IC.4
  Bottom 0.5: U$3.0 28.89,23.63 33.13,19.39 v34.23,19.39
CAN-STBY
  Top 0.5: CAN_IC.8 31.64,14.95 32.4,15.7 32.4,20.69 32.4,22.51 U$3.2
CAN-TXD-3V3  (via drill 0.6)
  Top 0.5: U$3.1 v30.98,20.09 | v34.11,16.25 34.03,16.17 35.26,14.95 CAN_IC.1
  Bottom 0.5: v34.11,16.25 30.98,19.38 v30.98,20.09
GND  (via drill 0.3, 0.35)  (225 unrouted)
  other vias: 22.94,49.18 26.5,49.7 27.2,44.73 29,47 34,45 33,50 36.97,47.76 39.96,50.2 42.4,46.5 37.1,43.25 34.6,41.2 37,41.1 42.7,42.5 40.3,44.8 45.55,47.82 49.01,50.25 49.2,45.6 46.2,42.8 48.85,42.05 51.07,47.8 53.8,47.6 56.56,50.16 60.01,47.67 58.8,45.3 58.7,42.7 60.5,42.5 62.48,50.17 62.6,44.52 64.13,41.77 60.5,38.8 66,39 71,41.9 73.82,44.77 73.04,47.71 72,51 74.1,50.3 74.65,53.19 74.13,41.08 73,37.5 74.82,34.69 60.8,35.25 62,33 62.9,30.4 74.2,30.4 72,28 65,28 61,27 57,29 50,29 47.39,31.69 30.21,35.1 47.27,37.7 33.5,37.3 36.2,33.1 35,29.8 40.1,28.9 44.4,28.9 47,26 41,26 36.2,26.1 33.23,28 33,32 31.25,30.02 25,30 28.2,32.98 28,29 25.5,31.2 44.44,34.62 31,26 27.8,25.1 25.05,21.33 34,21 38.01,20.86 38.16,16.05 38.1,12.5 24.88,17.83 26.08,14.55 26.46,18.81 29.47,13.49 41.2,15.1 38.73,5 44.58,21.49 43,20.36 47.4,16.8 47.1,21.5 49.06,22.08 51.55,22.12 50.65,16.24 53.82,16.89 53.69,13.26 58.2,13.2 51.1,6.3 48.8,10.9 49.45,14.38 44.63,5.2 61.7,4.1 58.73,16.82 62.57,21.25 68,21.4 61.04,14.8 66.6,16 63.1,12.61 69.55,13.1 65.8,9.58 60.88,9.55 63.1,9.7 71.2,10.3 69.1,18.5 72.01,16.14 73.6,12.3 76.4,10.4 40.1,18.8 23.7,2.8 16.7,2.8 9.7,2.8 9.7,8.8 12.7,18.8 14.7,13.8 18.7,13.8 21.31,13.79 23.7,23.8 23.7,26.8 12.7,22.8 6.7,25.8 3.7,32.8 23.7,29.8 23.7,32.8 17.7,36.8 6.7,36.8 11.7,45.8 7.6,46.6 3.7,50.8 7.7,52.8 8.7,54.8 16.7,47.8 26.2,54.3 31.2,57.6 25.7,60.8 20.7,60.8 14.7,60.8 10.7,58.8 59.9,6.1 64.7,4.8 66.7,4.8 69.2,4.8 71.8,4.7 74.5,7 73,9.4 65.7,23.8 65.26,18.7 74.7,23.8 41.59,12.21 10.62,15.79 52.91,26.03 26.1,11.5 26.1,7.5 35.59,11.21 65,47.1 25,41.1
  pour Top (rank 6): -9,97 -1,105 99,105 105,99 105,-1 101,-5 0,-5 -5,0 -5,94 -8,97
  pour Bottom (rank 6): -7,95 1,103 101,103 105,99 105,0 100,-5 1,-5 -7,3
GPIO1_A  (via drill 0.6)
  Top 0.5: v69.8,47.4 74.6,52.2 77.7,52.2 C10.1 79.25,52.14 PWM-ADC1.P$1
  Bottom 0.5: v69.8,47.4 66.9,47.4 59.69,40.19 52.68,40.19 51.37,38.87 U$3.16
GPIO1_B
  Top 0.5: U$3.15 54.62,38.87 56.6,40.85 71.27,40.85 C8.1 79.25,46.04 PWM-ADC1.P$2
GPIO2_A
  Top 0.5: U$3.14 57.63,40.12 76.74,40.12 77.43,40.7 C12.1 78.06,40.43 79.08,40.43 80.35,39.16 PWM-ADC2.P$1
GPIO2_B
  Top 0.5: PWM-ADC2.P$2 79.95,36.16 77.7,34.11 C11.1 75.93,35.6 62.19,35.6 U$3.13
GPIO3_A
  Top 0.5: PWM-ADC4.P$1 79.41,29.09 C14.1 64.38,29.09 U$3.12
GPIO3_B
  Top 0.5: U$3.11 57.66,22.35 76.98,22.35 77,22.37 77.16,22.37 C13.1 79.12,23.02 PWM-ADC4.P$2
GPIO4_A
  Top 0.5: PWM-ADC5.P$1 80.28,16.07 78.85,17.5 77.81,17.5 | 77.81,17.5 75.81,17.5 C16.1 | U$3.10 55.84,21.63 60.72,21.63 64.82,17.52 77.79,17.52 77.81,17.5
GPIO4_B
  Top 0.5: PWM-ADC5.P$2 79.09,11.36 C15.1 69.96,11.36 69.94,11.38 60.4,20.92 54.01,20.92 U$3.9
INT  (via drill 0.51)
  Top 0.5: U$3.4 38.6,22.92 43.74,17.78 v43.74,11.48
  Bottom 0.5: J3.4 43.74,4.15 43.74,5.01 v43.74,11.48
N$1
  Top 0.5: U$3.5 46.94,17.83 59.33,17.83 64.38,12.79 64.38,7.12 C31.1 65.64,6.01 UNUSEDPINS.5
N$2
  Top 0.5: BRAKE-MOTOR-ENCODER.P$1 43.55,52.8 41.44,50.69 R16.2
N$3
  Bottom 0.5: U$3.ON/OFF 59.46,36.87 SV1.3
N$4
  Bottom 0.5: U$3.PGM 59.46,34.33 SV1.2
N$5
  pour Top: 5.3,51.5 15.2,51.5 15.2,45.7 13.3,45.7 9.7,49.3 5.3,49.3
N$6
  pour Top: 16,4.7 16,8.6 13.8,10.8 13.8,14.7 10.7,14.7 10.7,4.7
N$7
  Top 0.5: IC1.4 8.41,47.98 R1.1
N$8
  Top 0.5: STEERING-MOTOR-ENCODER1.P$1 54.98,52.8 52.84,50.66 R12.2
N$9
  Top 1: JETSON.C R3.2
N$10
  Top 0.5: U$3.6 48.55,18.75 59.43,18.75 66.76,11.43 66.76,7.42 C32.1 68.18,5.97 UNUSEDPINS.4
N$11
  Top 1: U$1.PIN1 27.91,57.1 JETSON.A 34.18,50.83 NANO.P$2
N$12
  Top 0.5: U$3.7 50.39,19.46 59.73,19.46 69.36,9.83 69.36,7.24 C33.1 70.6,2.22 UNUSEDPINS.3
N$13
  Top 0.5: U$3.8 52.22,20.17 60.06,20.17 71.02,9.22 71.27,9.22 71.41,9.22 71.88,8.75 71.88,7.2 73.08,6 C34.1 73.1,2.51 UNUSEDPINS.2
N$24
  pour Top: 13.8,16.2 15.5,16.2 15.5,19.6 17,21.1 17,22.2 18.7,23.9 18.7,26.2 16.4,26.2 13.8,23.6
N$25  (via drill 0.6)
  Top 0.5: 23.72,21.33 -12V.A 23.59,19.1 v22.19,17.7 | 23.72,21.33 R7.1 | L1.2 20.22,24.38 21.6,23 22.05,23 23.72,21.33
  Bottom 0.5: v22.19,17.7 22.07,17.82 10.54,17.82 POWER.P$2
N$27
  Top 0.5: Q3.4 Q3.2
  pour Top: 14.7,12.8 14.7,10.5 17.4,7.8 17.4,4.7 24.8,4.7 24.8,12.8
N$28
  pour Top: 17.9,15.9 17.9,22.41 22.6,22.41 22.6,19.11 19.39,15.9
N$31
  Top 0.5: R6.2 23.76,16.32 -12V.C
N$32
  Top 0.5: R8.2 9.4,23.77 +12V.C
SCL0
  Bottom 0.5: U$3.19 45.48,37.07 45.48,30.53 50.02,26 50.02,18.3 56.91,11.4 J1.1
SDA0
  Bottom 0.5: J1.2 57.17,7.16 58.38,8.37 58.38,10.93 52.58,16.73 52.58,24.62 46.22,30.98 U$3.18
STEER_MOTOR0
  Top 0.5: U$3.21 40.58,40.85 49.47,40.85 52.5,43.88 C25.1 52.62,46.01 R13.2 52.8,48.77 R12.1
STEER_MOTOR1
  Top 0.5: U$3.20 41.14,38.9 42.39,40.15 49.77,40.15 52.15,42.52 55.19,42.52 C24.1 56.37,42.54 57.83,44 | R15.2 57.83,44 | 57.83,44 57.83,46.17 R14.1
STEER_POT
  Top 0.5: U$3.17 49.51,38.87 52.2,41.56 62.23,41.56 C29.1 63.74,43.24 R11.2 63.81,46.06 R9.1

### Text on the board
tPlace: AUTO / v3.0 2020
bPlace: AUTO / v3.0 2020
tNames: BRAKE / MOTOR | STEER / MOTOR | JETSON NANO | STEER / POT | GPIO1 | GPIO2 | GPIO3 | GPIO4 | UNUSED PINS | UNUSED PINS | UNUSED PINS | CAN& / POWER
bNames: JETSON / NANO | BRAKE / MOTOR | STEER / MOTOR | STEER / POT | GND | BRAKE_MOTOR_0 | GND | STEER_MOTOR_0 | GND | STEER_POT | GND | +5V | +5V | +5V | GPIO1 | +5V | GPIO1_A | +5V | BRAKE_MOTOR_1 | STEER_MOTOR_1 | GND | GPIO1_B | GND | GPIO2 | Programmer | +5V | GPIO2_A | ON/OFF | GND | GPIO2_B | PGM | GND | GPIO3 | +5V | GPIO3_A | GPIO3_B | GND | CAN& / POWER | Frame | GPIO4 | CAN-L | +5V | GPIO4_A | CAN-H | Voltage in | UNUSED PINS | GPIO4_B | GND | +5V | 5, PWM | 6, PWM | 7, PWM | 8, PWM | GND
tValues: Teensy 4.0